# EasyEDA schematic prob.json

## Sheets
1 Регистры: TITLE: Registers; REV: 1.0; Date: 03.07.2024; Sheet: 1/2; Company: Danik Music Inc.
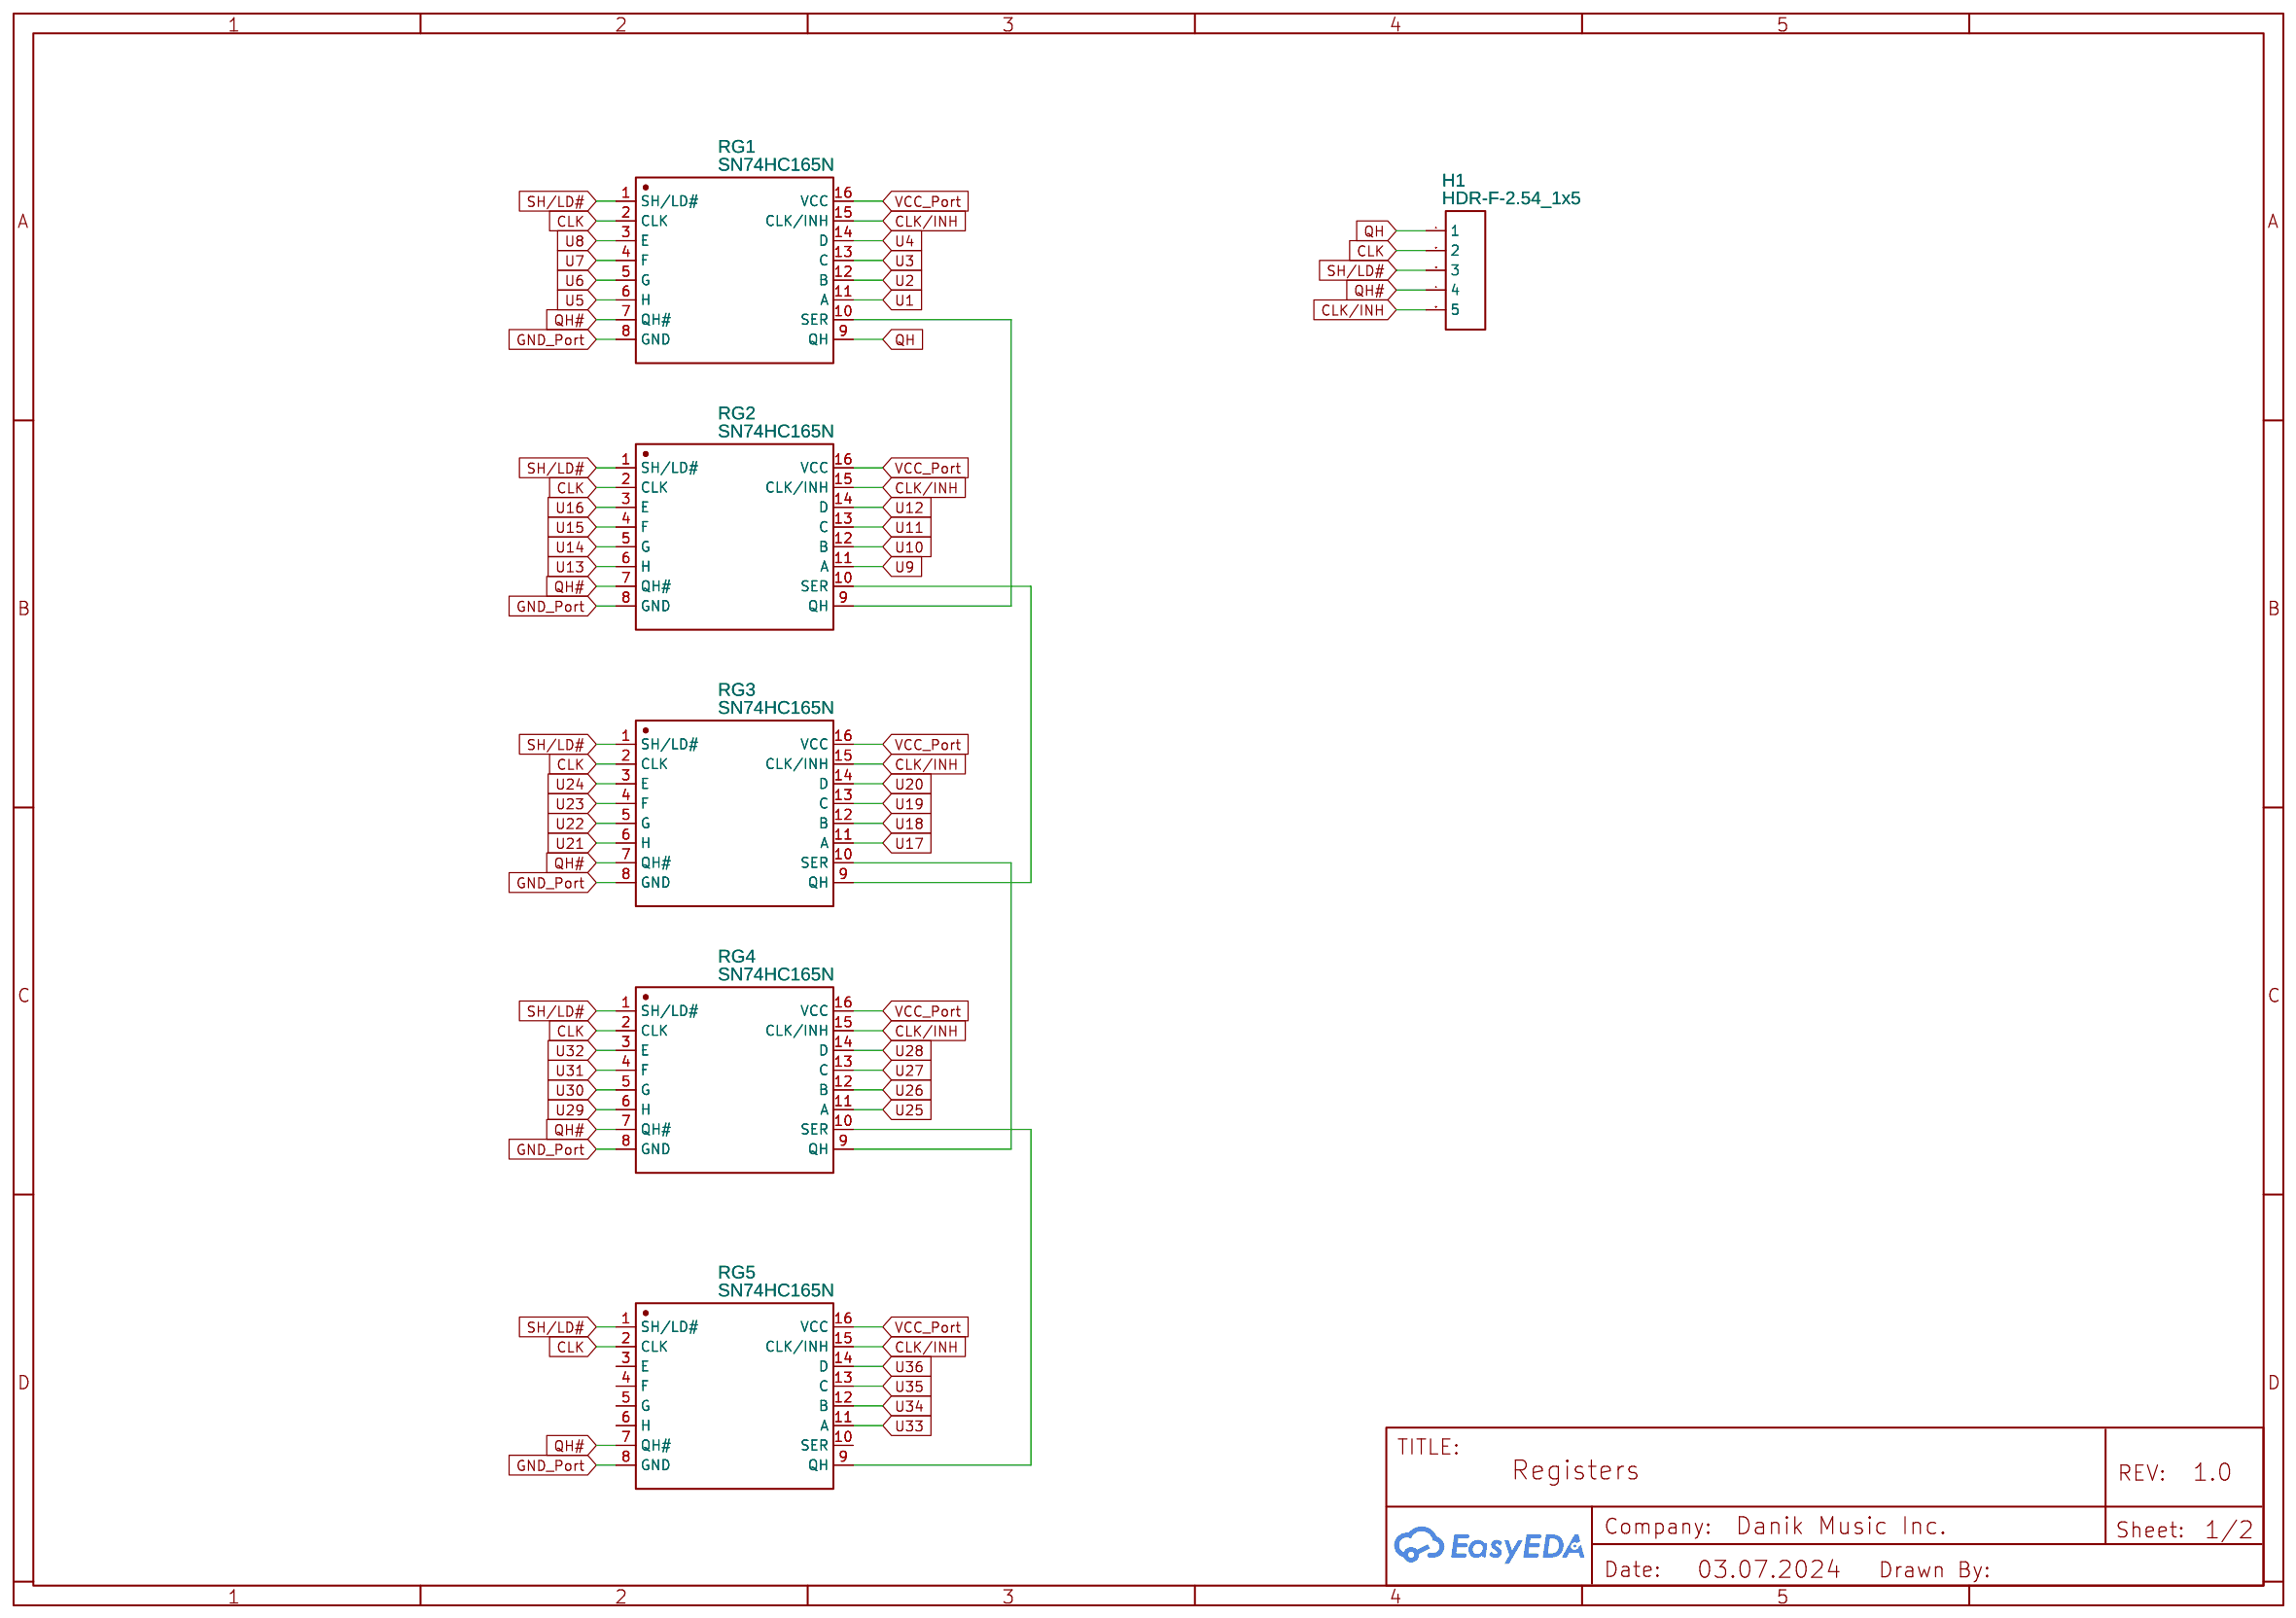
[diagram p0: Регистры]
2 Кнопки: TITLE: Buttons; Sheet: 2/2; Drawn By: danik_mus
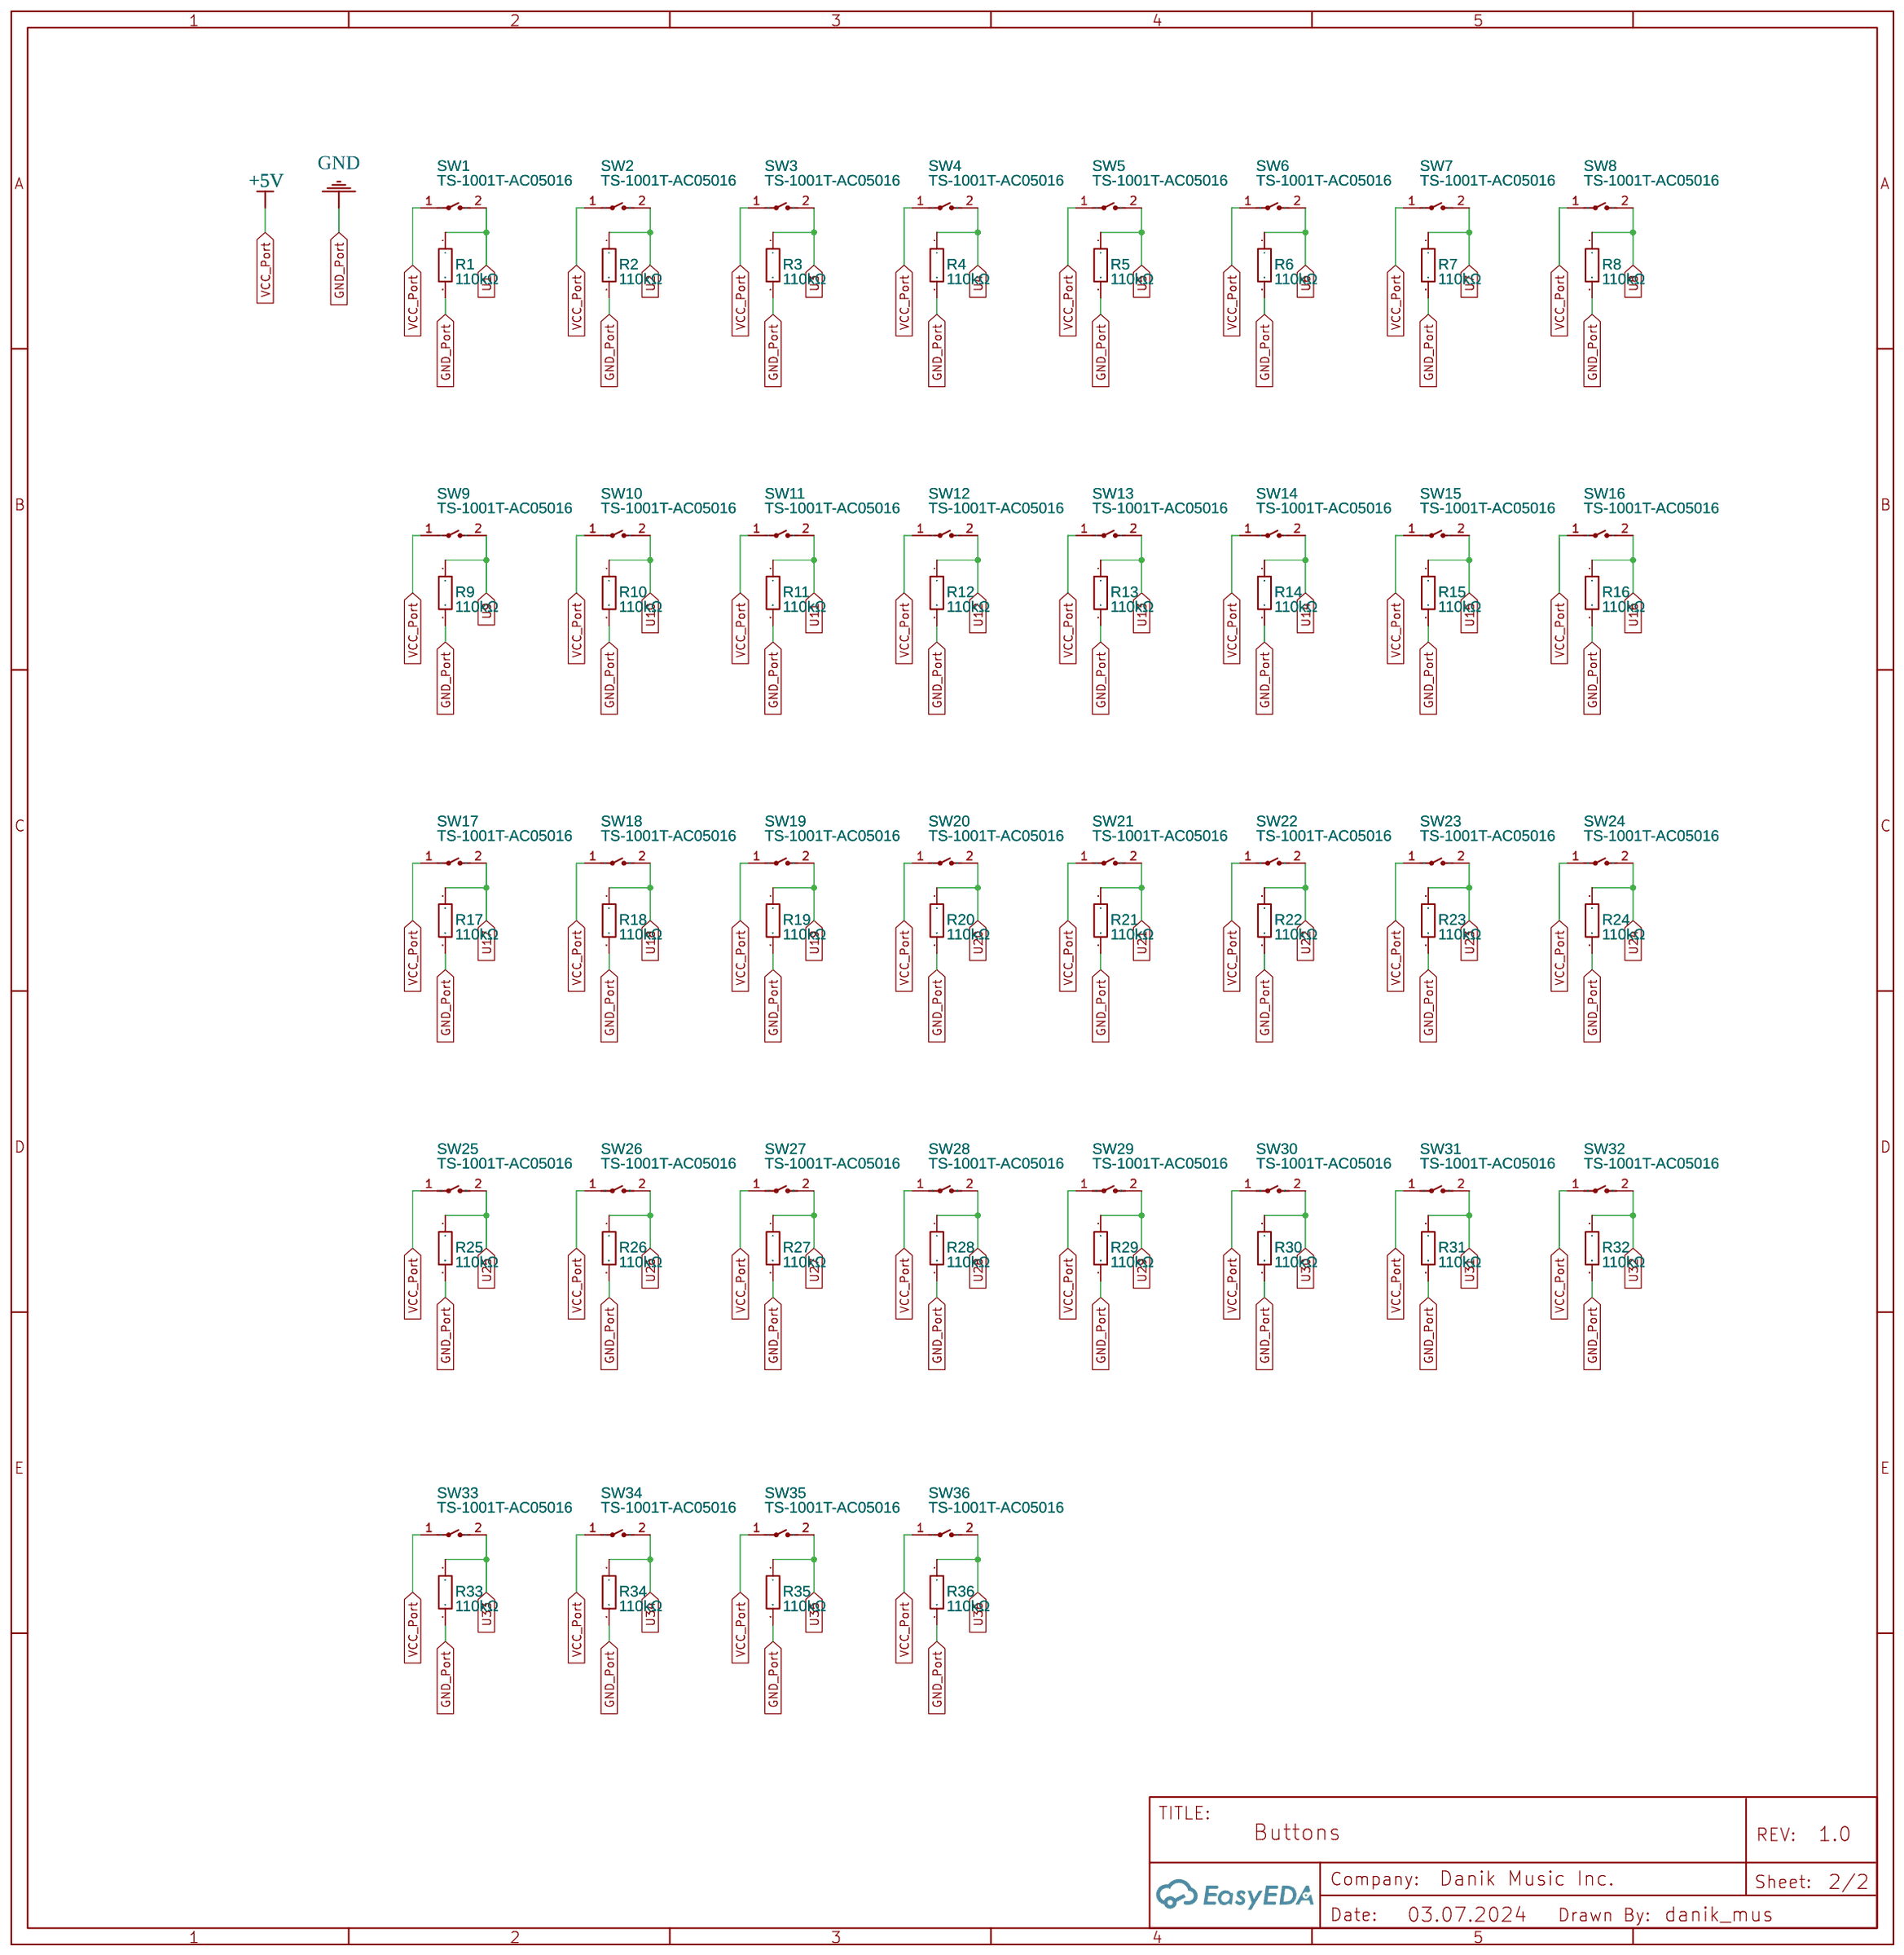
[diagram p1: Кнопки]

## Parts
sheet Кнопки
R1  110kΩ  [RES-TH_BD2.3-L6.5-P10.50-D0.5]
R2  110kΩ  [RES-TH_BD2.3-L6.5-P10.50-D0.5]
R3  110kΩ  [RES-TH_BD2.3-L6.5-P10.50-D0.5]
R4  110kΩ  [RES-TH_BD2.3-L6.5-P10.50-D0.5]
R5  110kΩ  [RES-TH_BD2.3-L6.5-P10.50-D0.5]
R6  110kΩ  [RES-TH_BD2.3-L6.5-P10.50-D0.5]
R7  110kΩ  [RES-TH_BD2.3-L6.5-P10.50-D0.5]
R8  110kΩ  [RES-TH_BD2.3-L6.5-P10.50-D0.5]
R9  110kΩ  [RES-TH_BD2.3-L6.5-P10.50-D0.5]
R10  110kΩ  [RES-TH_BD2.3-L6.5-P10.50-D0.5]
R11  110kΩ  [RES-TH_BD2.3-L6.5-P10.50-D0.5]
R12  110kΩ  [RES-TH_BD2.3-L6.5-P10.50-D0.5]
R13  110kΩ  [RES-TH_BD2.3-L6.5-P10.50-D0.5]
R14  110kΩ  [RES-TH_BD2.3-L6.5-P10.50-D0.5]
R15  110kΩ  [RES-TH_BD2.3-L6.5-P10.50-D0.5]
R16  110kΩ  [RES-TH_BD2.3-L6.5-P10.50-D0.5]
R17  110kΩ  [RES-TH_BD2.3-L6.5-P10.50-D0.5]
R18  110kΩ  [RES-TH_BD2.3-L6.5-P10.50-D0.5]
R19  110kΩ  [RES-TH_BD2.3-L6.5-P10.50-D0.5]
R20  110kΩ  [RES-TH_BD2.3-L6.5-P10.50-D0.5]
R21  110kΩ  [RES-TH_BD2.3-L6.5-P10.50-D0.5]
R22  110kΩ  [RES-TH_BD2.3-L6.5-P10.50-D0.5]
R23  110kΩ  [RES-TH_BD2.3-L6.5-P10.50-D0.5]
R24  110kΩ  [RES-TH_BD2.3-L6.5-P10.50-D0.5]
R25  110kΩ  [RES-TH_BD2.3-L6.5-P10.50-D0.5]
R26  110kΩ  [RES-TH_BD2.3-L6.5-P10.50-D0.5]
R27  110kΩ  [RES-TH_BD2.3-L6.5-P10.50-D0.5]
R28  110kΩ  [RES-TH_BD2.3-L6.5-P10.50-D0.5]
R29  110kΩ  [RES-TH_BD2.3-L6.5-P10.50-D0.5]
R30  110kΩ  [RES-TH_BD2.3-L6.5-P10.50-D0.5]
R31  110kΩ  [RES-TH_BD2.3-L6.5-P10.50-D0.5]
R32  110kΩ  [RES-TH_BD2.3-L6.5-P10.50-D0.5]
R33  110kΩ  [RES-TH_BD2.3-L6.5-P10.50-D0.5]
R34  110kΩ  [RES-TH_BD2.3-L6.5-P10.50-D0.5]
R35  110kΩ  [RES-TH_BD2.3-L6.5-P10.50-D0.5]
R36  110kΩ  [RES-TH_BD2.3-L6.5-P10.50-D0.5]
SW1  TS-1001T-AC05016  [SW-SMD_L6.0-W3.5-LS8.0-EH]
SW2  TS-1001T-AC05016  [SW-SMD_L6.0-W3.5-LS8.0-EH]
SW3  TS-1001T-AC05016  [SW-SMD_L6.0-W3.5-LS8.0-EH]
SW4  TS-1001T-AC05016  [SW-SMD_L6.0-W3.5-LS8.0-EH]
SW5  TS-1001T-AC05016  [SW-SMD_L6.0-W3.5-LS8.0-EH]
SW6  TS-1001T-AC05016  [SW-SMD_L6.0-W3.5-LS8.0-EH]
SW7  TS-1001T-AC05016  [SW-SMD_L6.0-W3.5-LS8.0-EH]
SW8  TS-1001T-AC05016  [SW-SMD_L6.0-W3.5-LS8.0-EH]
SW9  TS-1001T-AC05016  [SW-SMD_L6.0-W3.5-LS8.0-EH]
SW10  TS-1001T-AC05016  [SW-SMD_L6.0-W3.5-LS8.0-EH]
SW11  TS-1001T-AC05016  [SW-SMD_L6.0-W3.5-LS8.0-EH]
SW12  TS-1001T-AC05016  [SW-SMD_L6.0-W3.5-LS8.0-EH]
SW13  TS-1001T-AC05016  [SW-SMD_L6.0-W3.5-LS8.0-EH]
SW14  TS-1001T-AC05016  [SW-SMD_L6.0-W3.5-LS8.0-EH]
SW15  TS-1001T-AC05016  [SW-SMD_L6.0-W3.5-LS8.0-EH]
SW16  TS-1001T-AC05016  [SW-SMD_L6.0-W3.5-LS8.0-EH]
SW17  TS-1001T-AC05016  [SW-SMD_L6.0-W3.5-LS8.0-EH]
SW18  TS-1001T-AC05016  [SW-SMD_L6.0-W3.5-LS8.0-EH]
SW19  TS-1001T-AC05016  [SW-SMD_L6.0-W3.5-LS8.0-EH]
SW20  TS-1001T-AC05016  [SW-SMD_L6.0-W3.5-LS8.0-EH]
SW21  TS-1001T-AC05016  [SW-SMD_L6.0-W3.5-LS8.0-EH]
SW22  TS-1001T-AC05016  [SW-SMD_L6.0-W3.5-LS8.0-EH]
SW23  TS-1001T-AC05016  [SW-SMD_L6.0-W3.5-LS8.0-EH]
SW24  TS-1001T-AC05016  [SW-SMD_L6.0-W3.5-LS8.0-EH]
SW25  TS-1001T-AC05016  [SW-SMD_L6.0-W3.5-LS8.0-EH]
SW26  TS-1001T-AC05016  [SW-SMD_L6.0-W3.5-LS8.0-EH]
SW27  TS-1001T-AC05016  [SW-SMD_L6.0-W3.5-LS8.0-EH]
SW28  TS-1001T-AC05016  [SW-SMD_L6.0-W3.5-LS8.0-EH]
SW29  TS-1001T-AC05016  [SW-SMD_L6.0-W3.5-LS8.0-EH]
SW30  TS-1001T-AC05016  [SW-SMD_L6.0-W3.5-LS8.0-EH]
SW31  TS-1001T-AC05016  [SW-SMD_L6.0-W3.5-LS8.0-EH]
SW32  TS-1001T-AC05016  [SW-SMD_L6.0-W3.5-LS8.0-EH]
SW33  TS-1001T-AC05016  [SW-SMD_L6.0-W3.5-LS8.0-EH]
SW34  TS-1001T-AC05016  [SW-SMD_L6.0-W3.5-LS8.0-EH]
SW35  TS-1001T-AC05016  [SW-SMD_L6.0-W3.5-LS8.0-EH]
SW36  TS-1001T-AC05016  [SW-SMD_L6.0-W3.5-LS8.0-EH]
sheet Регистры
H1  HDR-F-2.54_1x5  [HDR-F-2.54_1X5]
RG1  SN74HC165N  [DIP-16_L19.8-W6.5-P2.54-LS7.6-BL]
RG2  SN74HC165N  [DIP-16_L19.8-W6.5-P2.54-LS7.6-BL]
RG3  SN74HC165N  [DIP-16_L19.8-W6.5-P2.54-LS7.6-BL]
RG4  SN74HC165N  [DIP-16_L19.8-W6.5-P2.54-LS7.6-BL]
RG5  SN74HC165N  [DIP-16_L19.8-W6.5-P2.54-LS7.6-BL]

## Library data of the parts
R1-R36 = CF1/4W-110KΩ±5% T52: Contributor: LCSC; Supplier: LCSC; Supplier Part: C120104; Manufacturer: CCO(千志电子); JLCPCB Part Class: Extended Part
SW1-SW36 = TS-1001T-AC05016: Contributor: LCSC; Supplier: LCSC; Supplier Part: C720486; Manufacturer: XUNPU(讯普); JLCPCB Part Class: Extended Part
H1 = HDR-F-2.54_1x5: Supplier Part: C50950; Supplier: LCSC; Contributor: LCEDA_Lib
RG1-RG5 = SN74HC165N: Supplier: LCSC; Manufacturer: TI(德州仪器); Supplier Part: C2909; JLCPCB Part Class: Extended Part

## Nets
+5V: RG1.16(VCC) RG2.16(VCC) RG3.16(VCC) RG4.16(VCC) RG5.16(VCC) SW1.1 SW2.1 SW3.1 SW4.1 SW5.1 SW6.1 SW7.1 SW8.1 SW9.1 SW10.1 SW11.1 SW12.1 SW13.1 SW14.1 SW15.1 SW16.1 SW17.1 SW18.1 SW19.1 SW20.1 SW21.1 SW22.1 SW23.1 SW24.1 SW25.1 SW26.1 SW27.1 SW28.1 SW29.1 SW30.1 SW31.1 SW32.1 SW33.1 SW34.1 SW35.1 SW36.1
GND: R1.2 R2.2 R3.2 R4.2 R5.2 R6.2 R7.2 R8.2 R9.2 R10.2 R11.2 R12.2 R13.2 R14.2 R15.2 R16.2 R17.2 R18.2 R19.2 R20.2 R21.2 R22.2 R23.2 R24.2 R25.2 R26.2 R27.2 R28.2 R29.2 R30.2 R31.2 R32.2 R33.2 R34.2 R35.2 R36.2 RG1.8(GND) RG2.8(GND) RG3.8(GND) RG4.8(GND) RG5.8(GND)
CLK: H1.2 RG1.2(CLK) RG2.2(CLK) RG3.2(CLK) RG4.2(CLK) RG5.2(CLK)
CLK/INH: H1.5 RG1.15(CLK/INH) RG2.15(CLK/INH) RG3.15(CLK/INH) RG4.15(CLK/INH) RG5.15(CLK/INH)
QH: H1.1 RG1.9(QH)
QH#: H1.4 RG1.7(QH#) RG2.7(QH#) RG3.7(QH#) RG4.7(QH#) RG5.7(QH#)
SH/LD#: H1.3 RG1.1(SH/LD#) RG2.1(SH/LD#) RG3.1(SH/LD#) RG4.1(SH/LD#) RG5.1(SH/LD#)
U1: R1.1 RG1.11(A) SW1.2
U2: R2.1 RG1.12(B) SW2.2
U3: R3.1 RG1.13(C) SW3.2
U4: R4.1 RG1.14(D) SW4.2
U5: R5.1 RG1.6(H) SW5.2
U6: R6.1 RG1.5(G) SW6.2
U7: R7.1 RG1.4(F) SW7.2
U8: R8.1 RG1.3(E) SW8.2
U9: R9.1 RG2.11(A) SW9.2
U10: R10.1 RG2.12(B) SW10.2
U11: R11.1 RG2.13(C) SW11.2
U12: R12.1 RG2.14(D) SW12.2
U13: R13.1 RG2.6(H) SW13.2
U14: R14.1 RG2.5(G) SW14.2
U15: R15.1 RG2.4(F) SW15.2
U16: R16.1 RG2.3(E) SW16.2
U17: R17.1 RG3.11(A) SW17.2
U18: R18.1 RG3.12(B) SW18.2
U19: R19.1 RG3.13(C) SW19.2
U20: R20.1 RG3.14(D) SW20.2
U21: R21.1 RG3.6(H) SW21.2
U22: R22.1 RG3.5(G) SW22.2
U23: R23.1 RG3.4(F) SW23.2
U24: R24.1 RG3.3(E) SW24.2
U25: R25.1 RG4.11(A) SW25.2
U26: R26.1 RG4.12(B) SW26.2
U27: R27.1 RG4.13(C) SW27.2
U28: R28.1 RG4.14(D) SW28.2
U29: R29.1 RG4.6(H) SW29.2
U30: R30.1 RG4.5(G) SW30.2
U31: R31.1 RG4.4(F) SW31.2
U32: R32.1 RG4.3(E) SW32.2
U33: R33.1 RG5.11(A) SW33.2
U34: R34.1 RG5.12(B) SW34.2
U35: R35.1 RG5.13(C) SW35.2
U36: R36.1 RG5.14(D) SW36.2
Net-(RG1-10): RG1.10(SER) RG2.9(QH)
Net-(RG2-10): RG2.10(SER) RG3.9(QH)
Net-(RG3-10): RG3.10(SER) RG4.9(QH)
Net-(RG4-10): RG4.10(SER) RG5.9(QH)

Not connected (* = marked no-connect by the designer): RG5 3(E) 4(F) 5(G) 6(H) 10(SER)
